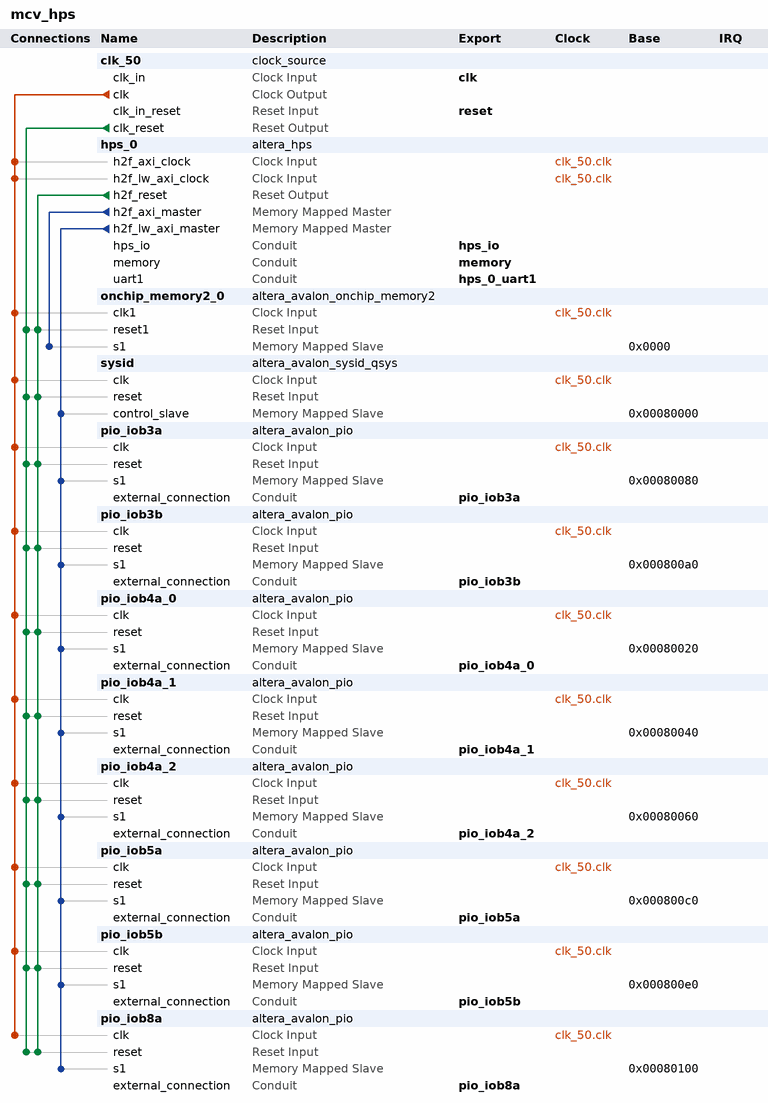
[diagram p0: system contents]
# Platform Designer (Qsys) system mcv_hps, Cyclone V 5CSXFC2C6U23C7
# Parameters at their usual value, and those the tool derives, are not listed.
package require -exact qsys 17.0
create_system mcv_hps
set_project_property DEVICE_FAMILY {Cyclone V}
set_project_property DEVICE 5CSXFC2C6U23C7

add_instance clk_50 clock_source 17.0
set_instance_parameter_value clk_50 clockFrequency 50000000

add_instance hps_0 altera_hps 17.0
set_instance_parameter_value hps_0 CAN0_Mode CAN
set_instance_parameter_value hps_0 CAN0_PinMuxing {HPS I/O Set 0}
set_instance_parameter_value hps_0 CAN1_Mode CAN
set_instance_parameter_value hps_0 CAN1_PinMuxing {HPS I/O Set 0}
set_instance_parameter_value hps_0 EMAC0_Mode RGMII
set_instance_parameter_value hps_0 EMAC0_PinMuxing {HPS I/O Set 0}
set_instance_parameter_value hps_0 EMAC1_Mode N/A
set_instance_parameter_value hps_0 EMAC1_PinMuxing Unused
set_instance_parameter_value hps_0 F2SCLK_COLDRST_Enable false
set_instance_parameter_value hps_0 F2SCLK_DBGRST_Enable false
set_instance_parameter_value hps_0 F2SCLK_WARMRST_Enable false
set_instance_parameter_value hps_0 F2SINTERRUPT_Enable true
set_instance_parameter_value hps_0 F2S_Width 0
set_instance_parameter_value hps_0 FPGA_PERIPHERAL_OUTPUT_CLOCK_FREQ_EMAC0_GTX_CLK 100
set_instance_parameter_value hps_0 FPGA_PERIPHERAL_OUTPUT_CLOCK_FREQ_EMAC0_MD_CLK 100.0
set_instance_parameter_value hps_0 FPGA_PERIPHERAL_OUTPUT_CLOCK_FREQ_EMAC1_GTX_CLK 100
set_instance_parameter_value hps_0 FPGA_PERIPHERAL_OUTPUT_CLOCK_FREQ_EMAC1_MD_CLK 100.0
set_instance_parameter_value hps_0 HLGPI_Enable true
set_instance_parameter_value hps_0 HPS_PROTOCOL DDR3
set_instance_parameter_value hps_0 I2C0_Mode I2C
set_instance_parameter_value hps_0 I2C0_PinMuxing {HPS I/O Set 0}
set_instance_parameter_value hps_0 I2C1_Mode N/A
set_instance_parameter_value hps_0 I2C1_PinMuxing Unused
set_instance_parameter_value hps_0 LWH2F_Enable true
set_instance_parameter_value hps_0 MEM_BANKADDR_WIDTH 3
set_instance_parameter_value hps_0 MEM_CLK_FREQ 333.3
set_instance_parameter_value hps_0 MEM_COL_ADDR_WIDTH 10
set_instance_parameter_value hps_0 MEM_DQ_WIDTH 32
set_instance_parameter_value hps_0 MEM_DRV_STR RZQ/6
set_instance_parameter_value hps_0 MEM_ROW_ADDR_WIDTH 15
set_instance_parameter_value hps_0 MEM_RTT_NOM RZQ/6
set_instance_parameter_value hps_0 MEM_RTT_WR {Dynamic ODT off}
set_instance_parameter_value hps_0 MEM_TCL 6
set_instance_parameter_value hps_0 MEM_TFAW_NS 40.0
set_instance_parameter_value hps_0 MEM_TINIT_US 512
set_instance_parameter_value hps_0 MEM_TRAS_NS 35.0
set_instance_parameter_value hps_0 MEM_TRCD_NS 13.75
set_instance_parameter_value hps_0 MEM_TREFI_US 3.9
set_instance_parameter_value hps_0 MEM_TRFC_NS 350.0
set_instance_parameter_value hps_0 MEM_TRP_NS 13.75
set_instance_parameter_value hps_0 MEM_TRRD_NS 12.0
set_instance_parameter_value hps_0 MEM_TRTP_NS 12.0
set_instance_parameter_value hps_0 MEM_VENDOR JEDEC
set_instance_parameter_value hps_0 MEM_VOLTAGE {1.35V DDR3L}
set_instance_parameter_value hps_0 MEM_WTCL 6
set_instance_parameter_value hps_0 QSPI_Mode N/A
set_instance_parameter_value hps_0 QSPI_PinMuxing Unused
set_instance_parameter_value hps_0 REF_CLK_FREQ 25.0
set_instance_parameter_value hps_0 S2FCLK_USER2CLK 5
set_instance_parameter_value hps_0 S2F_Width 2
set_instance_parameter_value hps_0 SDIO_Mode {8-bit Data}
set_instance_parameter_value hps_0 SDIO_PinMuxing {HPS I/O Set 0}
set_instance_parameter_value hps_0 SPIM1_Mode {Single Slave Select}
set_instance_parameter_value hps_0 SPIM1_PinMuxing {HPS I/O Set 0}
set_instance_parameter_value hps_0 STM_Enable false
set_instance_parameter_value hps_0 TIMING_BOARD_AC_SKEW 0.02
set_instance_parameter_value hps_0 TIMING_BOARD_AC_TO_CK_SKEW 0.0
set_instance_parameter_value hps_0 TIMING_BOARD_DQ_TO_DQS_SKEW 0.0
set_instance_parameter_value hps_0 TIMING_BOARD_MAX_CK_DELAY 0.6
set_instance_parameter_value hps_0 TIMING_BOARD_MAX_DQS_DELAY 0.6
set_instance_parameter_value hps_0 TIMING_BOARD_SKEW_BETWEEN_DQS 0.02
set_instance_parameter_value hps_0 TIMING_BOARD_SKEW_CKDQS_DIMM_MAX 0.01
set_instance_parameter_value hps_0 TIMING_BOARD_SKEW_CKDQS_DIMM_MIN -0.01
set_instance_parameter_value hps_0 TIMING_BOARD_SKEW_WITHIN_DQS 0.02
set_instance_parameter_value hps_0 TIMING_TDH 45
set_instance_parameter_value hps_0 TIMING_TDQSCK 225
set_instance_parameter_value hps_0 TIMING_TDQSQ 100
set_instance_parameter_value hps_0 TIMING_TDQSS 0.27
set_instance_parameter_value hps_0 TIMING_TDS 10
set_instance_parameter_value hps_0 TIMING_TDSH 0.18
set_instance_parameter_value hps_0 TIMING_TDSS 0.18
set_instance_parameter_value hps_0 TIMING_TIH 120
set_instance_parameter_value hps_0 TIMING_TIS 45
set_instance_parameter_value hps_0 TIMING_TQSH 0.4
set_instance_parameter_value hps_0 UART0_Mode {No Flow Control}
set_instance_parameter_value hps_0 UART0_PinMuxing {HPS I/O Set 0}
set_instance_parameter_value hps_0 UART1_Mode Full
set_instance_parameter_value hps_0 UART1_PinMuxing FPGA
set_instance_parameter_value hps_0 USB1_Mode SDR
set_instance_parameter_value hps_0 USB1_PinMuxing {HPS I/O Set 1}
set_instance_parameter_value hps_0 desired_cfg_clk_mhz 100.0
set_instance_parameter_value hps_0 desired_qspi_clk_mhz 400.0

add_instance onchip_memory2_0 altera_avalon_onchip_memory2 17.0
set_instance_parameter_value onchip_memory2_0 dataWidth 64
set_instance_parameter_value onchip_memory2_0 dualPort false
set_instance_parameter_value onchip_memory2_0 initMemContent true
set_instance_parameter_value onchip_memory2_0 initializationFileName onchip_mem.hex
set_instance_parameter_value onchip_memory2_0 memorySize 65536

add_instance sysid altera_avalon_sysid_qsys 17.0
set_instance_parameter_value sysid id 898316

add_instance pio_iob3a altera_avalon_pio 17.0
set_instance_parameter_value pio_iob3a captureEdge true
set_instance_parameter_value pio_iob3a direction Bidir
set_instance_parameter_value pio_iob3a simDoTestBenchWiring true
set_instance_parameter_value pio_iob3a width 16

add_instance pio_iob3b altera_avalon_pio 17.0
set_instance_parameter_value pio_iob3b captureEdge true
set_instance_parameter_value pio_iob3b direction Bidir
set_instance_parameter_value pio_iob3b simDoTestBenchWiring true
set_instance_parameter_value pio_iob3b width 32

add_instance pio_iob4a_0 altera_avalon_pio 17.0
set_instance_parameter_value pio_iob4a_0 captureEdge true
set_instance_parameter_value pio_iob4a_0 direction Bidir
set_instance_parameter_value pio_iob4a_0 simDoTestBenchWiring true
set_instance_parameter_value pio_iob4a_0 width 32

add_instance pio_iob4a_1 altera_avalon_pio 17.0
set_instance_parameter_value pio_iob4a_1 captureEdge true
set_instance_parameter_value pio_iob4a_1 direction Bidir
set_instance_parameter_value pio_iob4a_1 simDoTestBenchWiring true
set_instance_parameter_value pio_iob4a_1 width 32

add_instance pio_iob4a_2 altera_avalon_pio 17.0
set_instance_parameter_value pio_iob4a_2 captureEdge true
set_instance_parameter_value pio_iob4a_2 direction Bidir
set_instance_parameter_value pio_iob4a_2 simDoTestBenchWiring true
set_instance_parameter_value pio_iob4a_2 width 4

add_instance pio_iob5a altera_avalon_pio 17.0
set_instance_parameter_value pio_iob5a captureEdge true
set_instance_parameter_value pio_iob5a direction Bidir
set_instance_parameter_value pio_iob5a simDoTestBenchWiring true
set_instance_parameter_value pio_iob5a width 16

add_instance pio_iob5b altera_avalon_pio 17.0
set_instance_parameter_value pio_iob5b captureEdge true
set_instance_parameter_value pio_iob5b direction Bidir
set_instance_parameter_value pio_iob5b simDoTestBenchWiring true
set_instance_parameter_value pio_iob5b width 6

add_instance pio_iob8a altera_avalon_pio 17.0
set_instance_parameter_value pio_iob8a captureEdge true
set_instance_parameter_value pio_iob8a direction Bidir
set_instance_parameter_value pio_iob8a simDoTestBenchWiring true
set_instance_parameter_value pio_iob8a width 4

# connections
add_connection clk_50.clk hps_0.h2f_axi_clock clock
add_connection clk_50.clk hps_0.h2f_lw_axi_clock clock
add_connection clk_50.clk onchip_memory2_0.clk1 clock
add_connection clk_50.clk pio_iob3a.clk clock
add_connection clk_50.clk pio_iob3b.clk clock
add_connection clk_50.clk pio_iob4a_0.clk clock
add_connection clk_50.clk pio_iob4a_1.clk clock
add_connection clk_50.clk pio_iob4a_2.clk clock
add_connection clk_50.clk pio_iob5a.clk clock
add_connection clk_50.clk pio_iob5b.clk clock
add_connection clk_50.clk pio_iob8a.clk clock
add_connection clk_50.clk sysid.clk clock
add_connection clk_50.clk_reset onchip_memory2_0.reset1 reset
add_connection clk_50.clk_reset pio_iob3a.reset reset
add_connection clk_50.clk_reset pio_iob3b.reset reset
add_connection clk_50.clk_reset pio_iob4a_0.reset reset
add_connection clk_50.clk_reset pio_iob4a_1.reset reset
add_connection clk_50.clk_reset pio_iob4a_2.reset reset
add_connection clk_50.clk_reset pio_iob5a.reset reset
add_connection clk_50.clk_reset pio_iob5b.reset reset
add_connection clk_50.clk_reset pio_iob8a.reset reset
add_connection clk_50.clk_reset sysid.reset reset
add_connection hps_0.h2f_reset onchip_memory2_0.reset1 reset
add_connection hps_0.h2f_reset pio_iob3a.reset reset
add_connection hps_0.h2f_reset pio_iob3b.reset reset
add_connection hps_0.h2f_reset pio_iob4a_0.reset reset
add_connection hps_0.h2f_reset pio_iob4a_1.reset reset
add_connection hps_0.h2f_reset pio_iob4a_2.reset reset
add_connection hps_0.h2f_reset pio_iob5a.reset reset
add_connection hps_0.h2f_reset pio_iob5b.reset reset
add_connection hps_0.h2f_reset pio_iob8a.reset reset
add_connection hps_0.h2f_reset sysid.reset reset
add_connection hps_0.h2f_axi_master onchip_memory2_0.s1 avalon
set_connection_parameter_value hps_0.h2f_axi_master/onchip_memory2_0.s1 baseAddress 0x0000
add_connection hps_0.h2f_lw_axi_master pio_iob3a.s1 avalon
set_connection_parameter_value hps_0.h2f_lw_axi_master/pio_iob3a.s1 baseAddress 0x00080080
add_connection hps_0.h2f_lw_axi_master pio_iob3b.s1 avalon
set_connection_parameter_value hps_0.h2f_lw_axi_master/pio_iob3b.s1 baseAddress 0x000800a0
add_connection hps_0.h2f_lw_axi_master pio_iob4a_0.s1 avalon
set_connection_parameter_value hps_0.h2f_lw_axi_master/pio_iob4a_0.s1 baseAddress 0x00080020
add_connection hps_0.h2f_lw_axi_master pio_iob4a_1.s1 avalon
set_connection_parameter_value hps_0.h2f_lw_axi_master/pio_iob4a_1.s1 baseAddress 0x00080040
add_connection hps_0.h2f_lw_axi_master pio_iob4a_2.s1 avalon
set_connection_parameter_value hps_0.h2f_lw_axi_master/pio_iob4a_2.s1 baseAddress 0x00080060
add_connection hps_0.h2f_lw_axi_master pio_iob5a.s1 avalon
set_connection_parameter_value hps_0.h2f_lw_axi_master/pio_iob5a.s1 baseAddress 0x000800c0
add_connection hps_0.h2f_lw_axi_master pio_iob5b.s1 avalon
set_connection_parameter_value hps_0.h2f_lw_axi_master/pio_iob5b.s1 baseAddress 0x000800e0
add_connection hps_0.h2f_lw_axi_master pio_iob8a.s1 avalon
set_connection_parameter_value hps_0.h2f_lw_axi_master/pio_iob8a.s1 baseAddress 0x00080100
add_connection hps_0.h2f_lw_axi_master sysid.control_slave avalon
set_connection_parameter_value hps_0.h2f_lw_axi_master/sysid.control_slave baseAddress 0x00080000

# exported interfaces
add_interface clk clock sink
set_interface_property clk EXPORT_OF clk_50.clk_in
add_interface hps_0_uart1 conduit end
set_interface_property hps_0_uart1 EXPORT_OF hps_0.uart1
add_interface hps_io conduit end
set_interface_property hps_io EXPORT_OF hps_0.hps_io
add_interface memory conduit end
set_interface_property memory EXPORT_OF hps_0.memory
add_interface pio_iob3a conduit end
set_interface_property pio_iob3a EXPORT_OF pio_iob3a.external_connection
add_interface pio_iob3b conduit end
set_interface_property pio_iob3b EXPORT_OF pio_iob3b.external_connection
add_interface pio_iob4a_0 conduit end
set_interface_property pio_iob4a_0 EXPORT_OF pio_iob4a_0.external_connection
add_interface pio_iob4a_1 conduit end
set_interface_property pio_iob4a_1 EXPORT_OF pio_iob4a_1.external_connection
add_interface pio_iob4a_2 conduit end
set_interface_property pio_iob4a_2 EXPORT_OF pio_iob4a_2.external_connection
add_interface pio_iob5a conduit end
set_interface_property pio_iob5a EXPORT_OF pio_iob5a.external_connection
add_interface pio_iob5b conduit end
set_interface_property pio_iob5b EXPORT_OF pio_iob5b.external_connection
add_interface pio_iob8a conduit end
set_interface_property pio_iob8a EXPORT_OF pio_iob8a.external_connection
add_interface reset reset sink
set_interface_property reset EXPORT_OF clk_50.clk_in_reset

set_interconnect_requirement {$system} qsys_mm.clockCrossingAdapter HANDSHAKE
set_interconnect_requirement {$system} qsys_mm.maxAdditionalLatency 1

save_system mcv_hps.qsys
